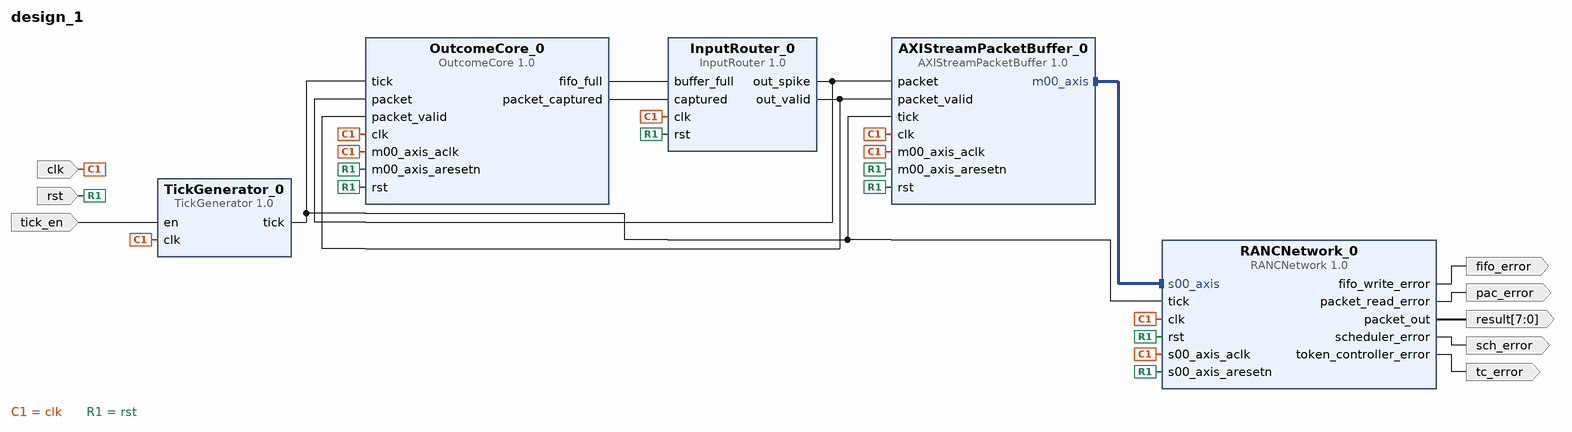
[diagram p0: block diagram of the top level]
# Vivado block design design_1, xc7z020clg484-1, Vivado 2019.2
create_bd_design design_1

create_bd_port -dir I -type clk clk
set_property -dict {CONFIG.FREQ_HZ 1000000} [get_bd_ports clk]
create_bd_port -dir I -type rst rst
set_property -dict {CONFIG.POLARITY ACTIVE_HIGH} [get_bd_ports rst]
create_bd_port -dir I -type ce tick_en
create_bd_port -dir O -from 7 -to 0 -type data result
create_bd_port -dir O -type data tc_error
create_bd_port -dir O -type data sch_error
create_bd_port -dir O -type data pac_error
create_bd_port -dir O -type data fifo_error

create_bd_cell -type ip -vlnv arizona.edu:user:InputRouter:1.0 InputRouter_0
create_bd_cell -type ip -vlnv arizona.edu:user:RANCNetwork:1.0 RANCNetwork_0
create_bd_cell -type ip -vlnv rcl.arizona.edu:RANC:TickGenerator:1.0 TickGenerator_0
create_bd_cell -type ip -vlnv arizona.edu:user:OutcomeCore:1.0 OutcomeCore_0
create_bd_cell -type ip -vlnv rcl.arizona.edu:RANC:AXIStreamPacketBuffer:1.0 AXIStreamPacketBuffer_0

# ---- connections ----

connect_bd_intf_net [get_bd_intf_pins AXIStreamPacketBuffer_0/m00_axis] [get_bd_intf_pins RANCNetwork_0/s00_axis]
connect_bd_net [get_bd_ports clk] \
  [get_bd_pins InputRouter_0/clk] [get_bd_pins TickGenerator_0/clk] [get_bd_pins AXIStreamPacketBuffer_0/clk] \
  [get_bd_pins OutcomeCore_0/clk] [get_bd_pins RANCNetwork_0/clk] [get_bd_pins AXIStreamPacketBuffer_0/m00_axis_aclk] \
  [get_bd_pins RANCNetwork_0/s00_axis_aclk] [get_bd_pins OutcomeCore_0/m00_axis_aclk]
connect_bd_net [get_bd_ports rst] \
  [get_bd_pins InputRouter_0/rst] [get_bd_pins AXIStreamPacketBuffer_0/rst] [get_bd_pins RANCNetwork_0/rst] \
  [get_bd_pins OutcomeCore_0/rst] [get_bd_pins AXIStreamPacketBuffer_0/m00_axis_aresetn] \
  [get_bd_pins RANCNetwork_0/s00_axis_aresetn] [get_bd_pins OutcomeCore_0/m00_axis_aresetn]
connect_bd_net [get_bd_ports tick_en] [get_bd_pins TickGenerator_0/en]
connect_bd_net [get_bd_pins TickGenerator_0/tick] \
  [get_bd_pins AXIStreamPacketBuffer_0/tick] [get_bd_pins RANCNetwork_0/tick] [get_bd_pins OutcomeCore_0/tick]
connect_bd_net [get_bd_pins InputRouter_0/out_spike] [get_bd_pins AXIStreamPacketBuffer_0/packet] [get_bd_pins OutcomeCore_0/packet]
connect_bd_net [get_bd_pins InputRouter_0/out_valid] [get_bd_pins AXIStreamPacketBuffer_0/packet_valid] [get_bd_pins OutcomeCore_0/packet_valid]
connect_bd_net [get_bd_pins RANCNetwork_0/packet_out] [get_bd_ports result]
connect_bd_net [get_bd_pins RANCNetwork_0/token_controller_error] [get_bd_ports tc_error]
connect_bd_net [get_bd_pins RANCNetwork_0/scheduler_error] [get_bd_ports sch_error]
connect_bd_net [get_bd_pins RANCNetwork_0/packet_read_error] [get_bd_ports pac_error]
connect_bd_net [get_bd_pins RANCNetwork_0/fifo_write_error] [get_bd_ports fifo_error]
connect_bd_net [get_bd_pins OutcomeCore_0/fifo_full] [get_bd_pins InputRouter_0/buffer_full]
connect_bd_net [get_bd_pins OutcomeCore_0/packet_captured] [get_bd_pins InputRouter_0/captured]

validate_bd_design
save_bd_design
